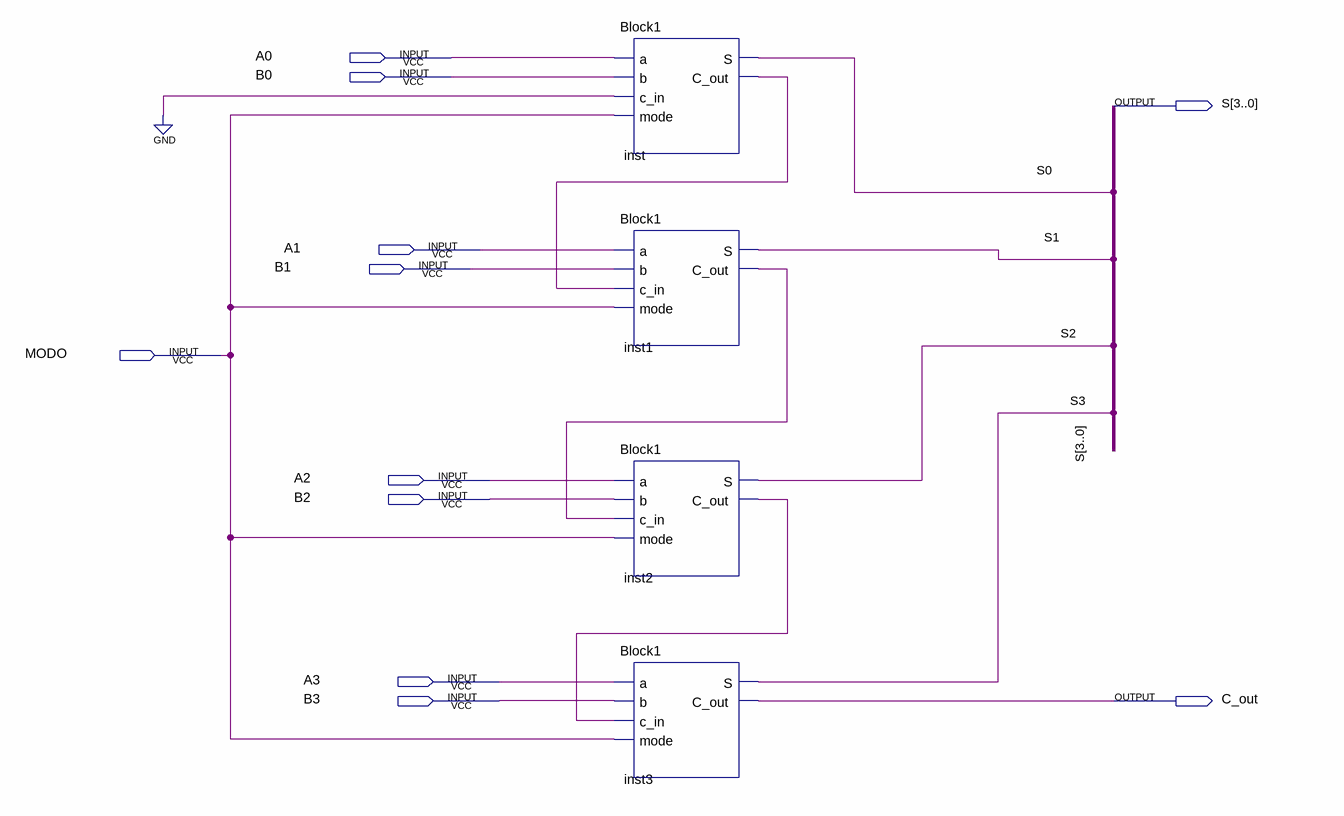
[diagram p0: schematic sheet]
// Quartus schematic contador_de_4bits.bdf as structural Verilog: 4 symbols, 11 pins
module contador_de_4bits (
  input  A0,
  input  B0,
  input  A1,
  input  B1,
  input  MODO,
  input  A2,
  input  B2,
  input  A3,
  input  B3,
  output [3:0] S,
  output C_out
);

  wire inst1_c_out, inst2_c_out, inst_c_out;

  Block1 inst (.a(A0), .b(B0), .c_in(1'b0), .mode(MODO), .S(S[0]), .C_out(inst_c_out));
  Block1 inst1 (.a(A1), .b(B1), .c_in(inst_c_out), .mode(MODO), .S(S[1]), .C_out(inst1_c_out));
  Block1 inst2 (.a(A2), .b(B2), .c_in(inst1_c_out), .mode(MODO), .S(S[2]), .C_out(inst2_c_out));
  Block1 inst3 (.a(A3), .b(B3), .c_in(inst2_c_out), .mode(MODO), .S(S[3]), .C_out(C_out));
endmodule
